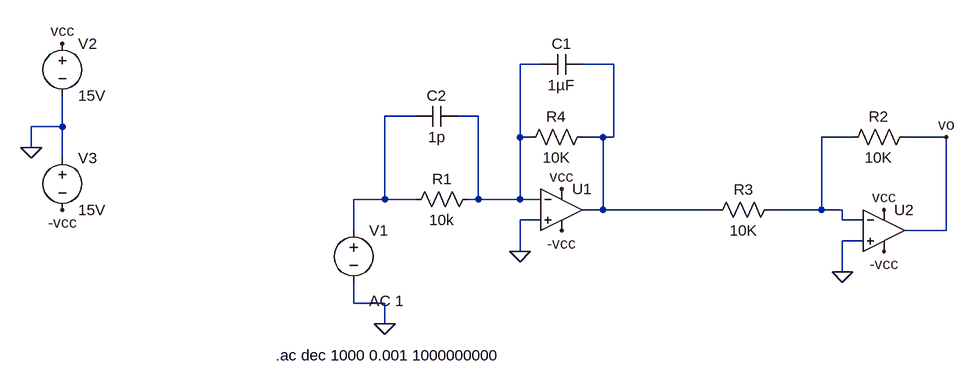
[diagram p0: schematic sss.asc]
sss.asc, the LTspice schematic file:
Version 4.1
SHEET 1 880 680
WIRE 0 -256 -32 -256
WIRE 112 -256 64 -256
WIRE -192 -176 -240 -176
WIRE -96 -176 -128 -176
WIRE -736 -160 -736 -208
WIRE -736 -160 -784 -160
WIRE -32 -144 -32 -256
WIRE -16 -144 -32 -144
WIRE 96 -144 64 -144
WIRE 112 -144 112 -256
WIRE 112 -144 96 -144
WIRE 480 -144 432 -144
WIRE 624 -144 560 -144
WIRE -784 -128 -784 -160
WIRE -736 -112 -736 -160
WIRE -240 -48 -240 -176
WIRE -240 -48 -288 -48
WIRE -192 -48 -240 -48
WIRE -96 -48 -96 -176
WIRE -96 -48 -112 -48
WIRE -32 -48 -32 -144
WIRE -32 -48 -96 -48
WIRE 0 -48 -32 -48
WIRE 96 -32 96 -144
WIRE 96 -32 64 -32
WIRE 272 -32 96 -32
WIRE 432 -32 432 -144
WIRE 432 -32 352 -32
WIRE 464 -32 432 -32
WIRE 0 -16 -32 -16
WIRE 464 -16 464 -32
WIRE 496 -16 464 -16
WIRE -288 0 -288 -48
WIRE 624 0 624 -144
WIRE 624 0 560 0
WIRE 496 16 464 16
WIRE -32 32 -32 -16
WIRE 464 64 464 16
WIRE -288 112 -288 80
WIRE -240 112 -288 112
WIRE -240 144 -240 112
FLAG -240 144 0
FLAG 32 -64 vcc
FLAG 528 -32 vcc
FLAG 32 0 -vcc
FLAG 528 32 -vcc
FLAG -32 32 0
FLAG 464 64 0
FLAG -736 -288 vcc
FLAG -736 -32 -vcc
FLAG 624 -144 vo
FLAG -784 -128 0
SYMBOL res -96 -64 R90
WINDOW 0 0 56 VBottom 2
WINDOW 3 32 56 VTop 2
SYMATTR InstName R1
SYMATTR Value 10k
SYMBOL voltage -288 -16 R0
WINDOW 123 24 124 Left 2
WINDOW 39 0 0 Left 0
SYMATTR Value2 AC 1
SYMATTR InstName V1
SYMATTR Value ""
SYMBOL res 576 -160 R90
WINDOW 0 0 56 VBottom 2
WINDOW 3 32 56 VTop 2
SYMATTR InstName R2
SYMATTR Value 10K
SYMBOL res 368 -48 R90
WINDOW 0 0 56 VBottom 2
WINDOW 3 32 56 VTop 2
SYMATTR InstName R3
SYMATTR Value 10K
SYMBOL res 80 -160 R90
WINDOW 0 0 56 VBottom 2
WINDOW 3 32 56 VTop 2
SYMATTR InstName R4
SYMATTR Value 10K
SYMBOL cap 64 -272 R90
WINDOW 0 0 32 VBottom 2
WINDOW 3 32 32 VTop 2
SYMATTR InstName C1
SYMATTR Value 1µF
SYMBOL voltage -736 -304 R0
SYMATTR InstName V2
SYMATTR Value 15V
SYMBOL voltage -736 -128 R0
SYMATTR InstName V3
SYMATTR Value 15V
SYMBOL cap -128 -192 R90
WINDOW 0 0 32 VBottom 2
WINDOW 3 32 32 VTop 2
SYMATTR InstName C2
SYMATTR Value 1p
SYMBOL OpAmps\\UniversalOpAmp 32 -32 R0
SYMATTR InstName U1
SYMATTR Value2 Avol=1Meg GBW=100G Vos=0
SYMBOL OpAmps\\UniversalOpAmp 528 0 R0
SYMATTR InstName U2
SYMATTR Value2 Avol=1Meg GBW=100G Vos=0
TEXT -408 192 Left 2 !.ac dec 1000 0.001 1000000000

The netlist it stands for:
* sss.asc
R1 N001 N003 10k
V1 N003 0 AC 1
R2 vo N004 10K
R3 N004 N002 10K
R4 N002 N001 10K
C1 N002 N001 1µF
V2 vcc 0 15V
V3 0 -vcc 15V
C2 N001 N003 1p
X§U1 0 N001 vcc -vcc N002 level1 Avol=1Meg GBW=100G Vos=0 En=0 Enk=0 In=0 Ink=0 Rin=500Meg  ; pins In+ In- V+ V- OUT
X§U2 0 N004 vcc -vcc vo level1 Avol=1Meg GBW=100G Vos=0 En=0 Enk=0 In=0 Ink=0 Rin=500Meg  ; pins In+ In- V+ V- OUT
.ac dec 1000 0.001 1000000000
.lib UniversalOpAmp1.lib
.backanno
.end